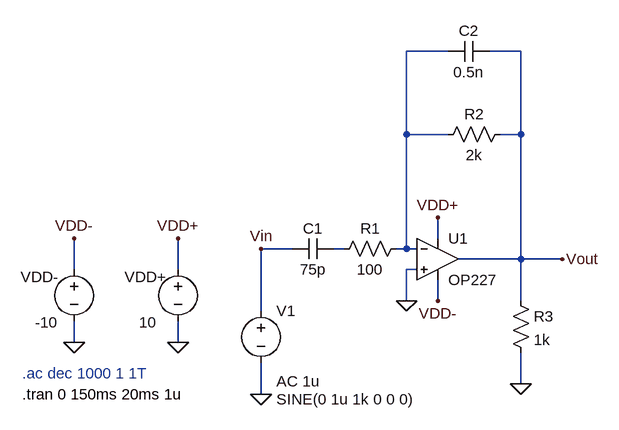
[diagram p0: schematic q7.asc]
q7.asc, the LTspice schematic file:
Version 4.1
SHEET 1 880 680
WIRE 208 -160 144 -160
WIRE 320 -160 272 -160
WIRE 144 -32 144 -160
WIRE 208 -32 144 -32
WIRE 320 -32 320 -160
WIRE 320 -32 288 -32
WIRE 192 128 192 96
WIRE -32 144 -80 144
WIRE 48 144 32 144
WIRE 144 144 144 -32
WIRE 144 144 128 144
WIRE 160 144 144 144
WIRE 320 160 320 -32
WIRE 320 160 224 160
WIRE 384 160 320 160
WIRE -368 176 -368 128
WIRE -208 176 -208 128
WIRE 160 176 144 176
WIRE 144 224 144 176
WIRE 192 224 192 192
WIRE 320 224 320 160
WIRE -80 240 -80 144
WIRE -368 288 -368 256
WIRE -208 288 -208 256
WIRE 320 352 320 304
WIRE -80 368 -80 320
FLAG -368 288 0
FLAG 384 160 Vout
FLAG -208 288 0
FLAG -368 128 VDD-
FLAG -208 128 VDD+
FLAG 192 96 VDD+
FLAG 192 224 VDD-
FLAG 320 352 0
FLAG -80 368 0
FLAG -80 144 Vin
FLAG 144 224 0
SYMBOL voltage -368 160 R0
WINDOW 0 -82 27 Left 2
WINDOW 3 -60 97 Left 2
WINDOW 123 0 0 Left 0
WINDOW 39 0 0 Left 0
SYMATTR InstName VDD-
SYMATTR Value -10
SYMBOL voltage -208 160 R0
WINDOW 0 -82 27 Left 2
WINDOW 3 -60 97 Left 2
WINDOW 123 0 0 Left 0
WINDOW 39 0 0 Left 0
SYMATTR InstName VDD+
SYMATTR Value 10
SYMBOL OpAmps\\OP227 192 96 R0
SYMATTR InstName U1
SYMBOL res 304 -48 R90
WINDOW 0 0 56 VBottom 2
WINDOW 3 32 56 VTop 2
SYMATTR InstName R2
SYMATTR Value 2k
SYMBOL res 144 128 R90
WINDOW 0 0 56 VBottom 2
WINDOW 3 32 56 VTop 2
SYMATTR InstName R1
SYMATTR Value 100
SYMBOL res 304 208 R0
SYMATTR InstName R3
SYMATTR Value 1k
SYMBOL cap 32 128 R90
WINDOW 0 0 32 VBottom 2
WINDOW 3 32 32 VTop 2
SYMATTR InstName C1
SYMATTR Value 75p
SYMBOL voltage -80 224 R0
WINDOW 3 24 152 Left 2
WINDOW 123 24 124 Left 2
WINDOW 39 0 0 Left 0
SYMATTR Value SINE(0 1u 1k 0 0 0)
SYMATTR Value2 AC 1u
SYMATTR InstName V1
SYMBOL cap 272 -176 R90
WINDOW 0 0 32 VBottom 2
WINDOW 3 32 32 VTop 2
SYMATTR InstName C2
SYMATTR Value 0.5n
TEXT -448 336 Left 2 ;.ac dec 1000 1 1T
TEXT -448 368 Left 2 !.tran 0 150ms 20ms 1u

The netlist it stands for:
* q7.asc
VDD- VDD- 0 -10
VDD+ VDD+ 0 10
X§U1 0 N001 VDD+ VDD- Vout OP227  ; pins In+ In- V+ V- OUT
R2 Vout N001 2k
R1 N001 N002 100
R3 Vout 0 1k
C1 N002 Vin 75p
V1 Vin 0 SINE(0 1u 1k 0 0 0) AC 1u
C2 Vout N001 0.5n
* .ac dec 1000 1 1T
.tran 0 150ms 20ms 1u
.backanno
.end

* Results of the author's LTspice run, read from the files saved beside the schematic
* Operating Point, zero values left out:
*   V(vdd+) = 10 V
*   V(vdd-) = -10 V
*   I(VDD-) = 2.718 mA
*   I(VDD+) = -2.718 mA
*   Ix(u1:3) = 2.718 mA
*   Ix(u1:4) = -2.718 mA
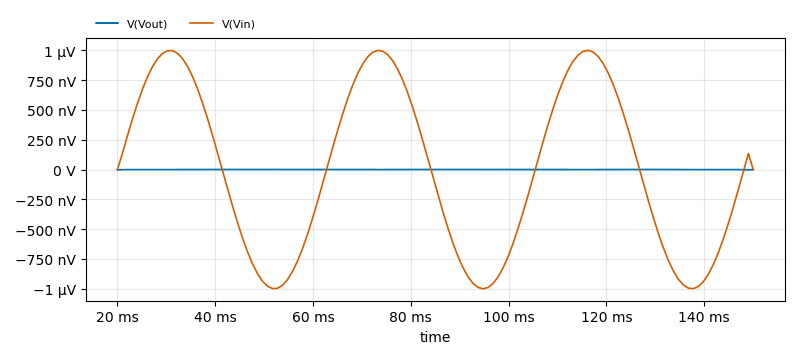
[diagram p1: Transient Analysis of q7.asc, plotted from the saved traces]
* Transient Analysis, 1 run:
*   V(Vout): min -942.4 pV, max 942.5 pV, average -14.44 pV, rms 671.4 pV, last -942.4 pV
*   V(Vin): min -1 µV, max 999.8 nV, average 1.036 nV, rms 701.7 nV, last 0 V